# Altium schematic sheet schematic sheet1.SchDoc
size A; SheetNumber: 1; SheetTotal: 2
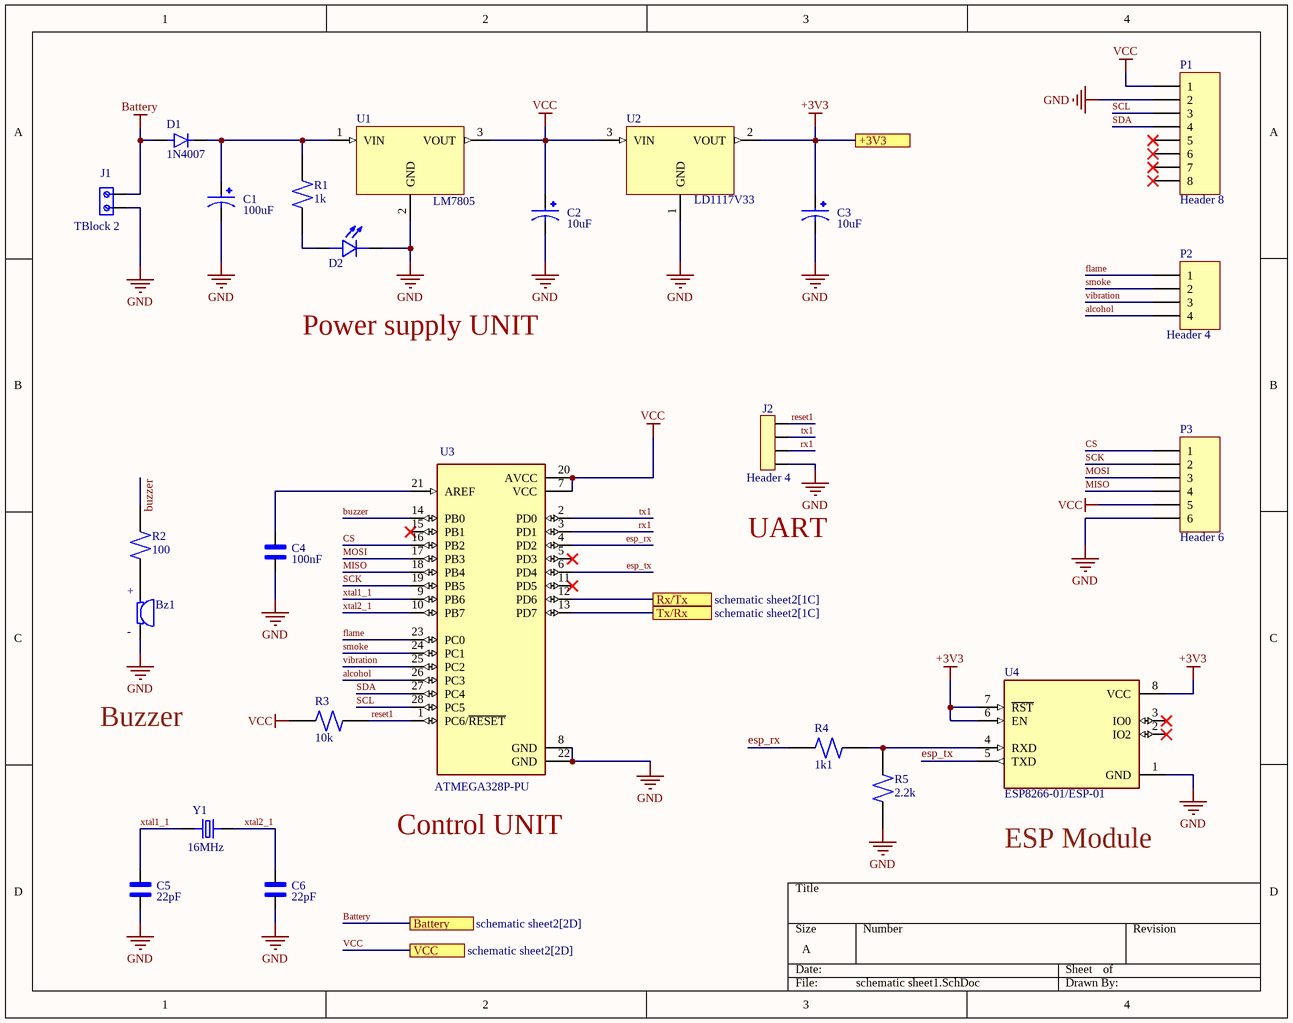
[diagram p0: schematic sheet1.SchDoc]

## Parts
Bz1  AI-1223-TWT-12V-R  [XDCR_AI-1223-TWT-12V-R]  (value not drawn)
C1  100uF  [CAPPRD500W50D500H1100]
C2  10uF  [CAPPRD500W50D500H1100]
C3  10uF  [CAPPRD500W50D500H1100]
C4  100nF  [CAPRB500W50L450T300H550]
C5  22pF  [CAPRB500W50L450T300H550]
C6  22pF  [CAPRB500W50L450T300H550]
D1  1N4007  [DIOAD1060W80L520D270]
D2  L08R5000Q1  [LEDRD254W57D500H1070]  (value not drawn)
J1  TBlock 2  [691111710002]
J2  Header 4  [SULLINS_PPTC041LFBN-RC]
P1  Header 8  [HDR1X8]
P2  Header 4  [HDR1X4]
P3  Header 6  [HDR1X6]
R1  1k  [RESAD1100W55L680D260]
R2  100  [RESAD1100W55L680D260]
R3  10k  [RESAD1100W55L680D260]
R4  1k1  [RESAD1100W55L680D260]
R5  2.2k  [RESAD1100W55L680D260]
U1  LM7805  [TO255P1020X450X1968-3]
U2  LD1117V33  [TO255P1020X450X1968-3]
U3  ATMEGA328P-PU  [DIP794W46P254L2967H457Q28B]
U4  ESP8266-01/ESP-01  [XCVR_ESP8266-01/ESP-01]
Y1  16MHz  [XTAL_ECS-160-20-4X]

## Ports
+3V3, Battery (see schematic sheet2[2D]), Rx/Tx (see schematic sheet2[1C]), Tx/Rx (see schematic sheet2[1C]), VCC (see schematic sheet2[2D])

## Nets
+3V3: C3.P U2.2(VOUT) U4.6(EN) U4.7(~{RST}) U4.8(VCC) ; port +3V3
Battery: D1.A J1.2 ; port Battery
GND: Bz1.N(NEG) C1.N C2.N C3.N C4.2 C5.2 C6.2 D2.C J1.1 J2.4 P1.2 P3.6 R5.1 U1.2(GND) U2.1(GND) U3.8(GND) U3.22(GND) U4.1(GND)
VCC: C2.P P1.1 P3.5 R3.1 U1.3(VOUT) U2.3(VIN) U3.7(VCC) U3.20(AVCC) ; port VCC
alcohol: P2.4 U3.26(PC3)
buzzer: R2.2 U3.14(PB0)
CS: P3.1 U3.16(PB2)
esp_rx: R4.2 U3.4(PD2)
esp_tx: U3.6(PD4) U4.5(TXD)
flame: P2.1 U3.23(PC0)
MISO: P3.4 U3.18(PB4)
MOSI: P3.3 U3.17(PB3)
reset1: J2.1 R3.2 U3.1(PC6/~{RESET})
rx1: J2.3 U3.3(PD1)
Rx/Tx: U3.12(PD6) ; port Rx/Tx
SCK: P3.2 U3.19(PB5)
SCL: P1.3 U3.28(PC5)
SDA: P1.4 U3.27(PC4)
smoke: P2.2 U3.24(PC1)
tx1: J2.2 U3.2(PD0)
Tx/Rx: U3.13(PD7) ; port Tx/Rx
vibration: P2.3 U3.25(PC2)
xtal1_1: C5.1 U3.9(PB6) Y1.1
xtal2_1: C6.1 U3.10(PB7) Y1.2
NetBz1_P: Bz1.P(POS) R2.1
NetC1_P: C1.P D1.C R1.1 U1.1(VIN)
NetC4_1: C4.1 U3.21(AREF)
NetD2_A: D2.A R1.2
NetR4_1: R4.1 R5.2 U4.4(RXD)

Not connected (* = marked no-connect by the designer): P1 5* 6* 7* 8*; U3 5(PD3)* 11(PD5)* 15(PB1)*; U4 2(IO2)* 3(IO0)*

## Notes on the sheet
- Power supply UNIT
- (near J2) UART
- Buzzer
- (near U3) Control UNIT
- (near U4) ESP Module
- (in symbol Buzzer) +; -

## Library data of the parts
Bz1 = Buzzer: ELECTRO-MECHANICAL AUDIO INDICATOR; MF: PUI Audio,; Availability: In Stock; Package: 2225 PUI Audio; Value: *; Price: None; MP: AI-1223-TWT-12V-R; Purchase-URL: https://pricing.snapeda.com/search/part/AI-1223-TWT-12V-R/?ref=eda
C1-C3 = Electrolytic capacitor: FS-A; MF: {'manufacturer': u'Panasonic'}; MP: EEUFS0J221B; Package: None; Value: *; Availability: Unavailable; Price: None
C4-C6 = Ceramic capacitor: 2200 pF Â±10% 250V Ceramic Capacitor X7R Radial; MF: TDK; MP: FG24X7R2E222KNT06; Digi-Key_Part_Number: 445-173386-1-ND; Purchase-URL: https://pricing.snapeda.com/search/part/FG24X7R2E222KNT06/?ref=eda; Check_prices: https://www.snapeda.com/parts/FG24X7R2E222KNT06/TDK/view-part/?ref=eda; Value: *; Package: Radial TDK; SnapEDA_Link: https://www.snapeda.com/parts/FG24X7R2E222KNT06/TDK/view-part/?ref=snap
D1 = 1N4007: Diode Switching 1KV 1A 2-Pin DO-41; Price: None; MP: 1N4007; Value: *; Availability: Unavailable; Package: None
D2 = LED: LED, Orange, Through Hole, T-1 3/4 (5mm), 30 mA, 2.1 V, 635 nm; MF: {'manufacturer': u'LED Technology'}; Price: None; Package: None; Availability: Unavailable; MP: L08R5000Q1; Value: *
J1 = Terminal Block - 2Pins: 2 Position Wire to Board Terminal Block Horizontal with Board 0.197 _5.00mm_ Through Hole; MF: Wurth Electronics; Value: *; Availability: Unavailable; MP: 691111710002; Price: None; Package: None; SnapEDA_Link: https://www.snapeda.com/parts/691111710002/Wurth%20Electronics%20Inc./view-part/1195092/?ref=snap
J2 = Female header - 4Pins: 4 Position Header Connector Through Hole; MP: PPTC041LFBN-RC; MF: Sullins Connector; Value: *; SnapEDA_Link: https://www.snapeda.com/parts/PPTC041LFBN-RC/Sullins%20Connector%20Solutions/view-part/285917/?ref=snap; Package: None; Availability: Warning; Check_prices: https://www.snapeda.com/parts/PPTC041LFBN-RC/Sullins%20Connector%20Solutions/view-part/285917/?ref=eda; Price: None; Purchase-URL: https://pricing.snapeda.com/search/part/PPTC041LFBN-RC/?ref=eda
P1 = Header 8: Header, 8-Pin; LatestRevisionDate: 17-Jul-2002; LatestRevisionNote: Re-released for DXP Platform.; Publisher: Altium Limited
P2 = Header 4: Header, 4-Pin; LatestRevisionDate: 17-Jul-2002; LatestRevisionNote: Re-released for DXP Platform.; Publisher: Altium Limited
P3 = Header 6: Header, 6-Pin; LatestRevisionDate: 17-Jul-2002; LatestRevisionNote: Re-released for DXP Platform.; Publisher: Altium Limited
R1-R5 = Resistor (0.25W): (MFR-25FBF52-10K) 10,2 kOhm bei 1% 0,25W, 1/4W Durchbohrlochwiderstand Axial Metal Film; MF: Yageo; Digi-Key_Part_Number: 10.2KXBK-ND; SnapEDA_Link: https://www.snapeda.com/parts/MFR-25FBF52-10K/Yageo/view-part/424333/?ref=snap; Package: Axial Yageo; Purchase-URL: https://pricing.snapeda.com/search/part/MFR-25FBF52-10K/?ref=eda; MP: MFR-25FBF52-10K; Value: *
U1 = LM78__: MP: LM7805CT/NOPB; Price: None; Value: *; Availability: Unavailable; Package: None
U3 = ATMEGA328P-PU: ATmega Series 20 MHz 32 KB Flash 2 KB SRAM 8-Bit Microcontroller - DIP-28; Value: *; MP: ATMEGA328P-PU; Package: None; Availability: Unavailable; Price: None
U4 = ESP8266-01 Module: MakerFocus 4pcs ESP8266 ESP-01 Serial Wireless WiFi Transceiver Receiver Module 1MB SPI Flash DC3.0-3.6V Internet of Things WiFi Module Board Compatible with Ar duino; Value: *; MP: ESP8266-01/ESP-01; Package: None; Availability: Unavailable; Price: None
Y1 = Crystal oscilator: CRYSTAL T/H; MF: {'manufacturer': u'ECS Inc.'}; MP: ECS-160-S-4; Package: None; Value: *; Availability: Unavailable; Price: None
U2 = LD1117V33: Package: None; MP: LD1117V33; Price: None; Availability: Unavailable; Value: *